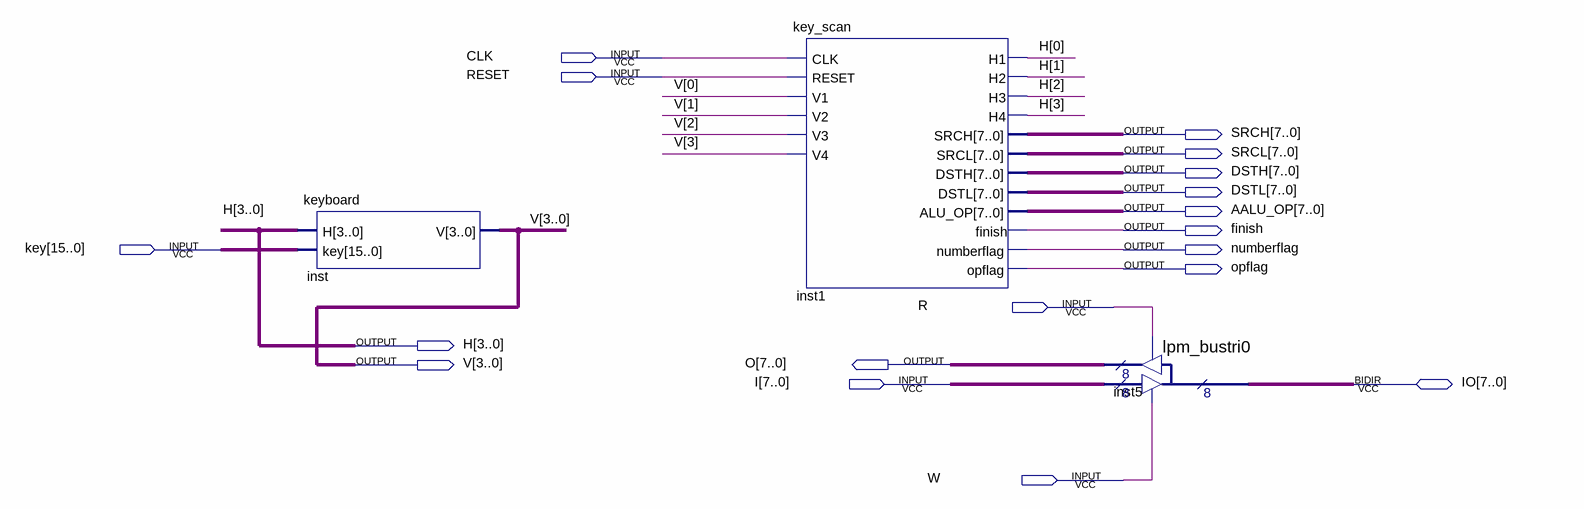
[diagram p0: schematic sheet]
// Quartus schematic CPU.bdf as structural Verilog: 3 symbols, 18 pins
module CPU (
  input  CLK,
  input  RESET,
  input  [15:0] key,
  input  R,
  input  [7:0] I,
  input  W,
  inout  [7:0] IO,
  output [7:0] SRCH,
  output [7:0] SRCL,
  output [7:0] DSTH,
  output [7:0] DSTL,
  output [7:0] AALU_OP,
  output finish,
  output numberflag,
  output opflag,
  output [3:0] H,
  output [3:0] V,
  output [7:0] O
);

  keyboard inst (.H(H), .key(key), .V(V));
  key_scan inst1 (
    .CLK(CLK), .RESET(RESET), .V1(V[0]), .V2(V[1]), .V3(V[2]), .V4(V[3]), .H1(H[0]), .H2(H[1]), .H3(H[2]),
    .H4(H[3]), .SRCH(SRCH), .SRCL(SRCL), .DSTH(DSTH), .DSTL(DSTL), .ALU_OP(AALU_OP), .finish(finish),
    .numberflag(numberflag), .opflag(opflag));
  lpm_bustri0 inst5 (.enabledt(W), .data(I), .enabletr(R), .result(O), .tridata(IO));
endmodule
